# Altium schematic sheet BTM875-E.SchDoc
size A4; SheetNumber: 1; SheetTotal: 1
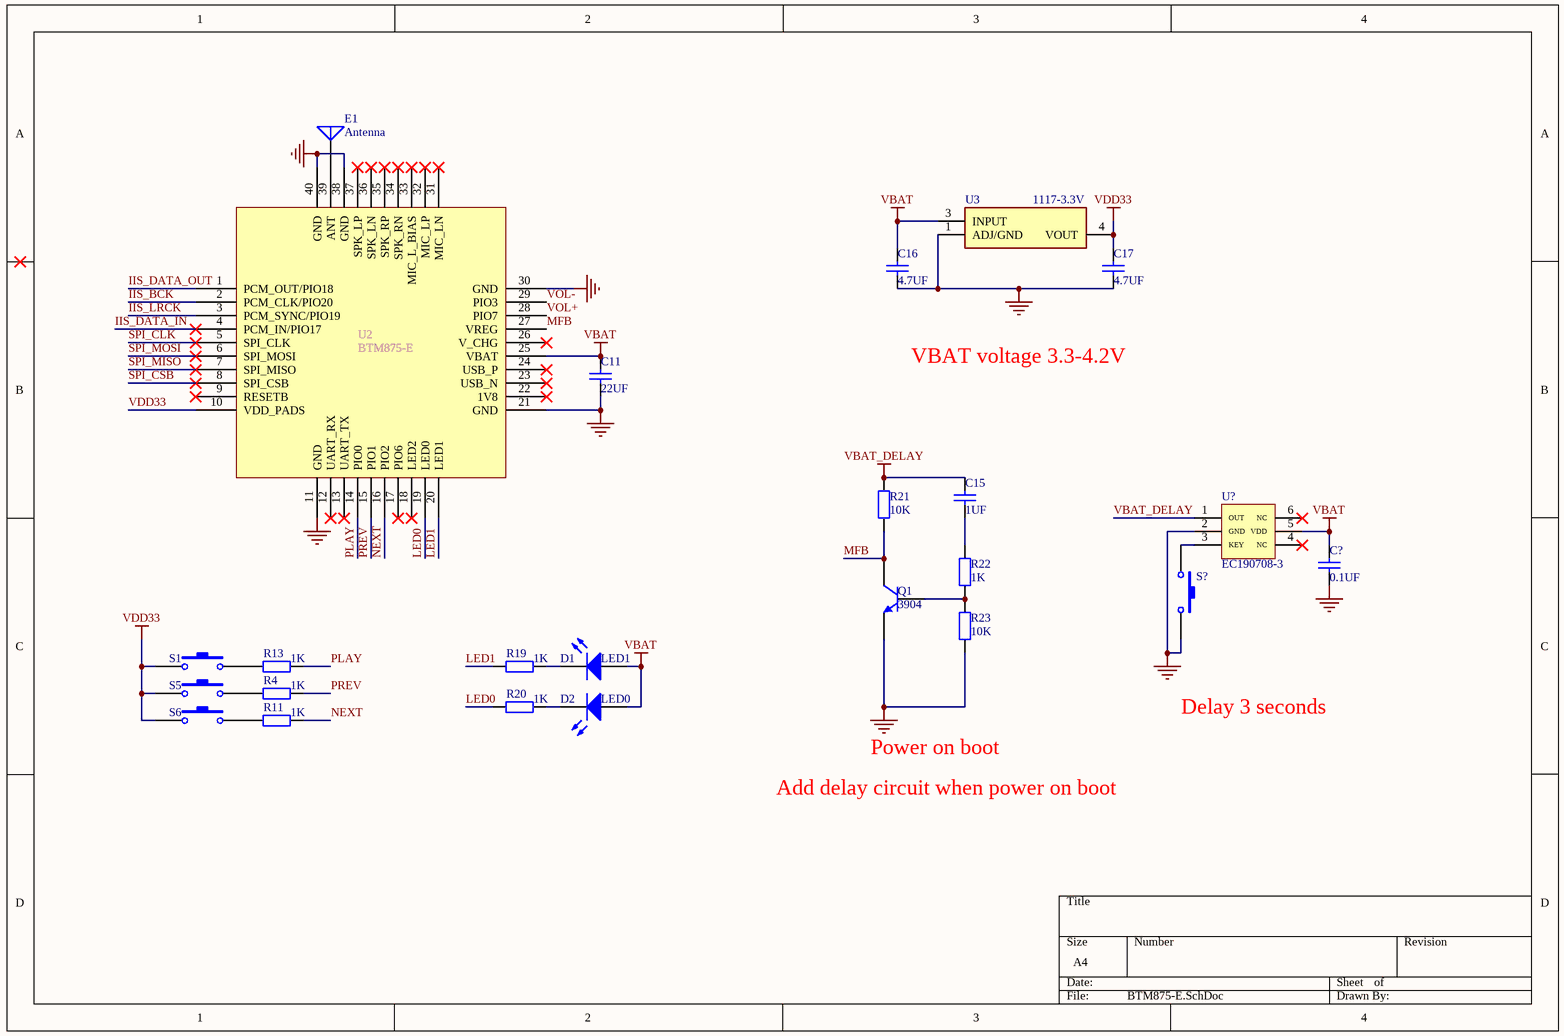
[diagram p0: BTM875-E.SchDoc]

## Parts
C11  value 22UF  [RAD-0.3]  (hidden comment: Cap)
C15  value 1UF  [RAD-0.3]  (hidden comment: Cap)
C16  value 4.7UF  [RAD-0.3]  (hidden comment: Cap)
C17  value 4.7UF  [RAD-0.3]  (hidden comment: Cap)
C?  value 0.1UF  [RAD-0.3]  (hidden comment: Cap)
D1  LED1  [3.5X2.8X1.9]
D2  LED0  [LED-1]
E1  Antenna  [PIN1]
Q1  3904  [TO-92A]
R4  value 1K  [AXIAL-0.4]  (hidden comment: Res2)
R11  value 1K  [AXIAL-0.4]  (hidden comment: Res2)
R13  value 1K  [AXIAL-0.4]  (hidden comment: Res2)
R19  value 1K  [AXIAL-0.4]  (hidden comment: Res2)
R20  value 1K  [AXIAL-0.4]  (hidden comment: Res2)
R21  value 10K  [AXIAL-0.4]  (hidden comment: Res2)
R22  value 1K  [AXIAL-0.4]  (hidden comment: Res2)
R23  value 10K  [AXIAL-0.4]  (hidden comment: Res2)
S1  SW-PB  [SPST-2]  (value not drawn)
S5  SW-PB  [SPST-2]  (value not drawn)
S6  SW-PB  [SPST-2]  (value not drawn)
S?  SW-PB  [SPST-2]  (value not drawn)
U2  BTM875-E  [LCCS100P1150X1150X200-40N]  (value not drawn)  (part A of 3)
U3  1117-3.3V  [TO228P991X238-3N]
U?  EC190708-3  [SOT95P280X135-6N]

## Nets
GND: C11.1 C16.1 C17.1 C?.1 Q1.1(E) R23.1 S?.1 U2.11(GND) U2.21(GND) U2.30(GND) U2.38(GND) U2.40(GND) U3.1(ADJ/GND) U?.2(GND)
VBAT: C11.2 C16.2 C?.2 D1.1(A) D2.1(A) U2.25(VBAT) U3.3(INPUT) U?.5(VDD)
VBAT_DELAY: C15.2 R21.2 U?.1(OUT)
VDD33: C17.2 S1.1 S5.1 S6.1 U2.10(VDD_PADS) U3.4(VOUT)
IIS_BCK: U2.2(PCM_CLK/PIO20)
IIS_DATA_IN: U2.4(PCM_IN/PIO17)
IIS_DATA_OUT: U2.1(PCM_OUT/PIO18)
IIS_LRCK: U2.3(PCM_SYNC/PIO19)
LED0: R20.1 U2.19(LED0)
LED1: R19.1 U2.20(LED1)
MFB: Q1.3(C) R21.1 U2.27(VREG)
NEXT: R11.2 U2.16(PIO2)
PLAY: R13.2 U2.14(PIO0)
PREV: R4.2 U2.15(PIO1)
SPI_CLK: U2.5(SPI_CLK)
SPI_CSB: U2.8(SPI_CSB)
SPI_MISO: U2.7(SPI_MISO)
SPI_MOSI: U2.6(SPI_MOSI)
VOL+: U2.28(PIO7)
VOL-: U2.29(PIO3)
NetC15_1: C15.1 R22.2
NetD1_2: D1.2(K) R19.2
NetD2_2: D2.2(K) R20.2
NetE1_1: E1.1(A) U2.39(ANT)
NetQ1_2: Q1.2(B) R22.1 R23.2
NetR4_1: R4.1 S5.2
NetR11_1: R11.1 S6.2
NetR13_1: R13.1 S1.2
NetS?_2: S?.2 U?.3(KEY)

Not connected (* = marked no-connect by the designer): U2 9(RESETB)* 12(UART_RX)* 13(UART_TX)* 17(PIO6)* 18(LED2)* 22(1V8)* 23(USB_N)* 24(USB_P)* 26(V_CHG)* 31(MIC_LN)* 32(MIC_LP)* 33(MIC_L_BIAS)* 34(SPK_RN)* 35(SPK_RP)* 36(SPK_LN)* 37(SPK_LP)*; U? 4(NC)* 6(NC)*

## Notes on the sheet
- VBAT voltage 3.3-4.2V
- Delay 3 seconds
- Power on boot
- Add delay circuit when power on boot

## Library data of the parts
C11 C15-C17 C? = Cap: Capacitor; Published: 8-Jun-2000; LatestRevisionDate: 17-Jul-2002; LatestRevisionNote: Re-released for DXP Platform.; PackageReference: RAD-0.3; Publisher: Altium Limited; PackageDescription: Radial Cap, Thru-Hole; 2 Leads; 0.3 in Pin Spacing
D1 = LED3: Typical BLUE SiC LED; Published: 8-Jun-2000; LatestRevisionDate: 17-Dec-2003; LatestRevisionNote: PCB Footprint replaced.; DatasheetVersion: 16-Apr-2002; PackageVersion: 16-Apr-2002; PackageReference: 3.5X2.8X1.9; Publisher: Altium Limited; PackageDescription: SM LED; 2 C-Bend Leads; Body 3.5 x 2.8 x 1.9 mm, inc leads (LxWxH typ)
D2 = LED1: Typical RED GaAs LED; Published: 8-Jun-2000; LatestRevisionDate: 08-Jul-2005; LatestRevisionNote: Mech Layer 1 removed.; PackageReference: LED-1; Publisher: Altium Limited; PackageDescription: LED; 2 Leads
E1 = Antenna: Generic Antenna; Published: 24-Mar-1999; LatestRevisionDate: 17-Jul-2002; LatestRevisionNote: Re-released for DXP Platform.; PackageReference: PIN1; Publisher: Altium Limited
Q1 = 2N3904: NPN General Purpose Amplifier; Published: 8-Jun-2000; LatestRevisionDate: 15-Jan-2003; LatestRevisionNote: PCB Footprint 'BCY-W3/D4.7' replaced; DatasheetVersion: 1997; PackageVersion: Sep-1998; PackageReference: TO-92A; Publisher: Altium Limited; PackageDescription: TO, Flat Index; 3 In-Line, Axial Leads; Body Dia. 4.5mm; Leads 0.51 x 0.48 mm (max); ComponentLink1Description: Manufacturer Link; ComponentLink1URL: http://www.fairchildsemi.com/; ComponentLink2Description: Datasheet; ComponentLink2URL: http://www.fairchildsemi.com/ds/2N%2F2N3904.pdf
R4 R11 R13 R19-R23 = Res2: Resistor; Published: 8-Jun-2000; LatestRevisionDate: 17-Jul-2002; LatestRevisionNote: Re-released for DXP Platform.; PackageReference: AXIAL-0.4; Publisher: Altium Limited; PackageDescription: Axial Device, Thru-Hole; 2 Leads; 0.4 in Pin Spacing
S1 S5 S6 S? = SW-PB: Switch; Published: 24-Mar-1999; LatestRevisionDate: 17-Jul-2002; LatestRevisionNote: Re-released for DXP Platform.; PackageReference: SPST-2; Publisher: Altium Limited; PackageDescription: Switch; 2 Leads
U3 = LM1117DT-3.3: Linear voltage regulator,LM1117DT-3.3; Manufacturer_Name: Texas Instruments; Geometry.Height: 2.38mm; Manufacturer_Part_Number: LM1117DT-3.3; Mouser Part Number: 926-LM1117DT-33; Mouser Price/Stock: https://www.mouser.co.uk/ProductDetail/Texas-Instruments/LM1117DT-33?qs=X1J7HmVL2ZHthPtGC9yV6Q%3D%3D; Arrow Part Number: LM1117DT-3.3; Arrow Price/Stock: https://www.arrow.com/en/products/lm1117dt-3.3/texas-instruments; Datasheet Link: https://datasheet.datasheetarchive.com/originals/distributors/Datasheets-22/DSA-425268.pdf